# EAGLE design TR_UBL_Splitter_V1p1 (EAGLE 9.6.2)

## Sheet 1 of 2
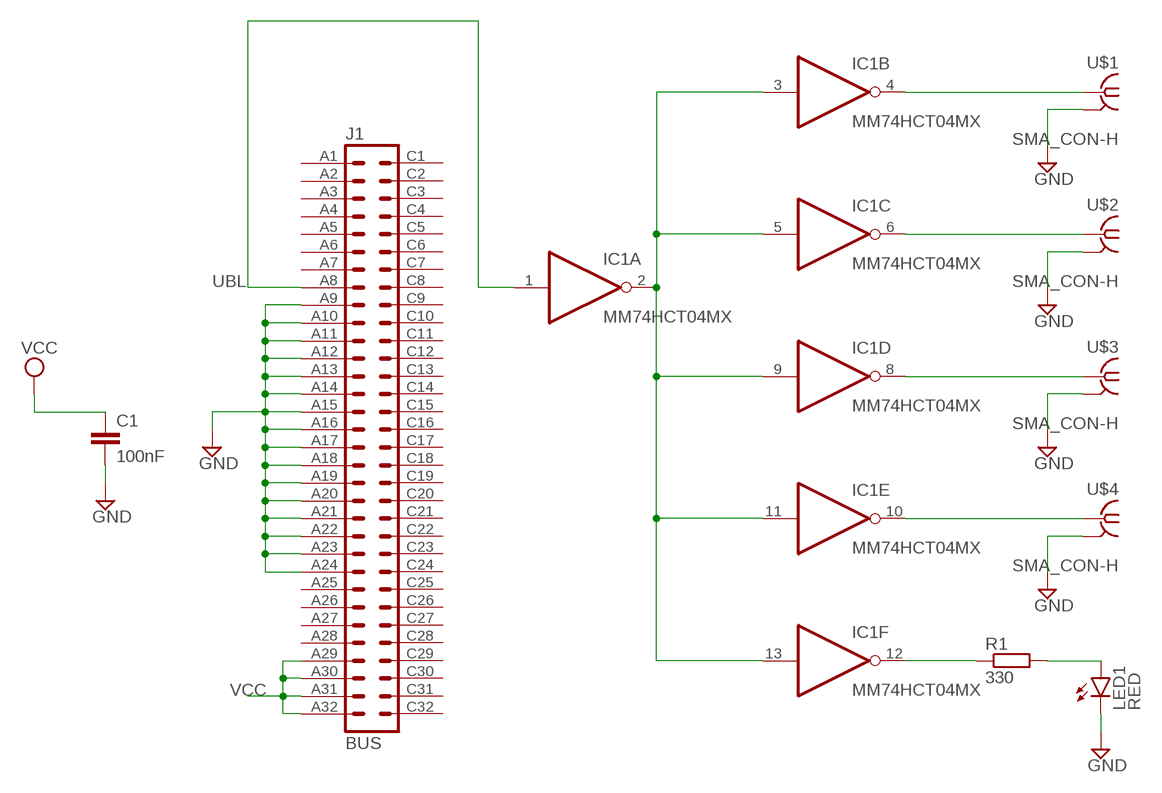
[diagram p0: schematic, sheet 1]

### Parts
C1  100nF  C-EUC0603  [C0603]
IC1  MM74HCT04MX  7404D  [SO14]
J1  BUS  VG64P  [VG64P]
LED1  RED  LED3MM  [LED3MM]
R1  330  R-EU_R0603  [R0603]
U$1  SMA_CON-H  [BU-SMA-H]
U$2  SMA_CON-H  [BU-SMA-H]
U$3  SMA_CON-H  [BU-SMA-H]
U$4  SMA_CON-H  [BU-SMA-H]

### Nets
GND: C1.2 J1.A9 J1.A10 J1.A11 J1.A12 J1.A13 J1.A14 J1.A15 J1.A16 J1.A17 J1.A18 J1.A19 J1.A20 J1.A21 J1.A22 J1.A23 J1.A24 LED1.K(C) U$1.2(GND) U$1.3(GND) U$1.4(GND) U$1.5(GND) U$2.2(GND) U$2.3(GND) U$2.4(GND) U$2.5(GND) U$3.2(GND) U$3.3(GND) U$3.4(GND) U$3.5(GND) U$4.2(GND) U$4.3(GND) U$4.4(GND) U$4.5(GND)
N$1: IC1.2(A:O) IC1.3(B:I) IC1.5(C:I) IC1.9(D:I) IC1.11(E:I) IC1.13(F:I)
N$2: IC1.4(B:O) U$1.1
N$3: LED1.A R1.2
N$4: IC1.6(C:O) U$2.1
N$5: IC1.12(F:O) R1.1
N$6: IC1.8(D:O) U$3.1
N$7: IC1.10(E:O) U$4.1
UBL: IC1.1(A:I) J1.A8
VCC: C1.1 J1.A29 J1.A30 J1.A31 J1.A32
Unconnected: J1.A1 J1.A2 J1.A3 J1.A4 J1.A5 J1.A6 J1.A7 J1.A25 J1.A26 J1.A27 J1.A28 J1.C1 J1.C2 J1.C3 J1.C4 J1.C5 J1.C6 J1.C7 J1.C8 J1.C9 J1.C10 J1.C11 J1.C12 J1.C13 J1.C14 J1.C15 J1.C16 J1.C17 J1.C18 J1.C19 J1.C20 J1.C21 J1.C22 J1.C23 J1.C24 J1.C25 J1.C26 J1.C27 J1.C28 J1.C29 J1.C30 J1.C31 J1.C32

## Sheet 2 of 2

## Power pins joined to a net without a drawn wire
GND: IC1.7(P:GND)
VCC: IC1.14(P:VCC)

## Library data of the parts
C1 = rcl:C-EU: CAPACITOR, European symbol; SPICEPREFIX: C
IC1 = 74xx-us:74*04: Hex INVERTER
J1 = 19inch:VG64: PCB EUROCARD, 64-pin type C/AC, 2.54 mm
LED1 = led:LED: LED OSRAM: - CHIPLED LG R971, LG N971, LY N971, LG Q971, LY Q971, LO R971, LY R971 LH N974, LH R974 LS Q976, LO Q976, LY Q976 LO Q996 - Hyper CHIPLED LW Q18S LB Q993, LB Q99A, LB R99A - SideLED LS A670, LO A670, LY A670, LG A670, LP A670 LB A673, LV A673, LT A673, LW A673 LH A674 LY A675 LS A676, LA A676, LO A676, LY A676, LW A676 LS A679, LY A679, LG A679 - Hyper Micro SIDELED® LS Y876, LA Y876, LO Y876, LY Y876 LT Y87S - SmartLED LW L88C, LW L88S LB L89C, LB L89S, LG L890 LS L89K, LO L89K, LY L89K LS L896, LA L896, LO L896, LY L896 - TOPLED LS T670, LO T670, LY T670, LG T670, LP T670 LSG T670, LSP T670, LSY T670, LOP T670, LYG T670 LG T671, LOG T671, LSG T671 LB T673, LV T673, LT T673, LW T673 LH T674 LS T676, LA T676, LO T676, LY T676, LB T676, LH T676, LSB T676, LW T676 LB T67C, LV T67C, LT T67C, LS T67K, LO T67K, LY T67K, LW E67C LS E67B, LA E67B, LO E67B, LY E67B, LB E67C, LV E67C, LT E67C LW T67C LS T679, LY T679, LG T679 LS T770, LO T770, LY T770, LG T770, LP T770 LB T773, LV T773, LT T773, LW T773 LH T774 LS E675, LA E675, LY E675, LS T675 LS T776, LA T776, LO T776, LY T776, LB T776 LHGB T686 LT T68C, LB T68C - Hyper Mini TOPLED® LB M676 - Mini TOPLED Santana® LG M470 LS M47K, LO M47K, LY M47K Source: http://www.osram.convergy.de LUXEON: - LUMILED® LXK2-PW12-R00, LXK2-PW12-S00, LXK2-PW14-U00, LXK2-PW14-V00 LXK2-PM12-R00, LXK2-PM12-S00, LXK2-PM14-U00 LXK2-PE12-Q00, LXK2-PE12-R00, LXK2-PE12-S00, LXK2-PE14-T00, LXK2-PE14-U00 LXK2-PB12-K00, LXK2-PB12-L00, LXK2-PB12-M00, LXK2-PB14-N00, LXK2-PB14-P00, LXK2-PB14-Q00 LXK2-PR12-L00, LXK2-PR12-M00, LXK2-PR14-Q00, LXK2-PR14-R00 LXK2-PD12-Q00, LXK2-PD12-R00, LXK2-PD12-S00 LXK2-PH12-R00, LXK2-PH12-S00 LXK2-PL12-P00, LXK2-PL12-Q00, LXK2-PL12-R00 Source: www.luxeon.com KINGBRIGHT: KA-3528ASYC Source: www.kingbright.com
R1 = rcl:R-EU_: RESISTOR, European symbol; SPICEPREFIX: R
U$1-U$4 = Orzada:SMA_CON

## Board
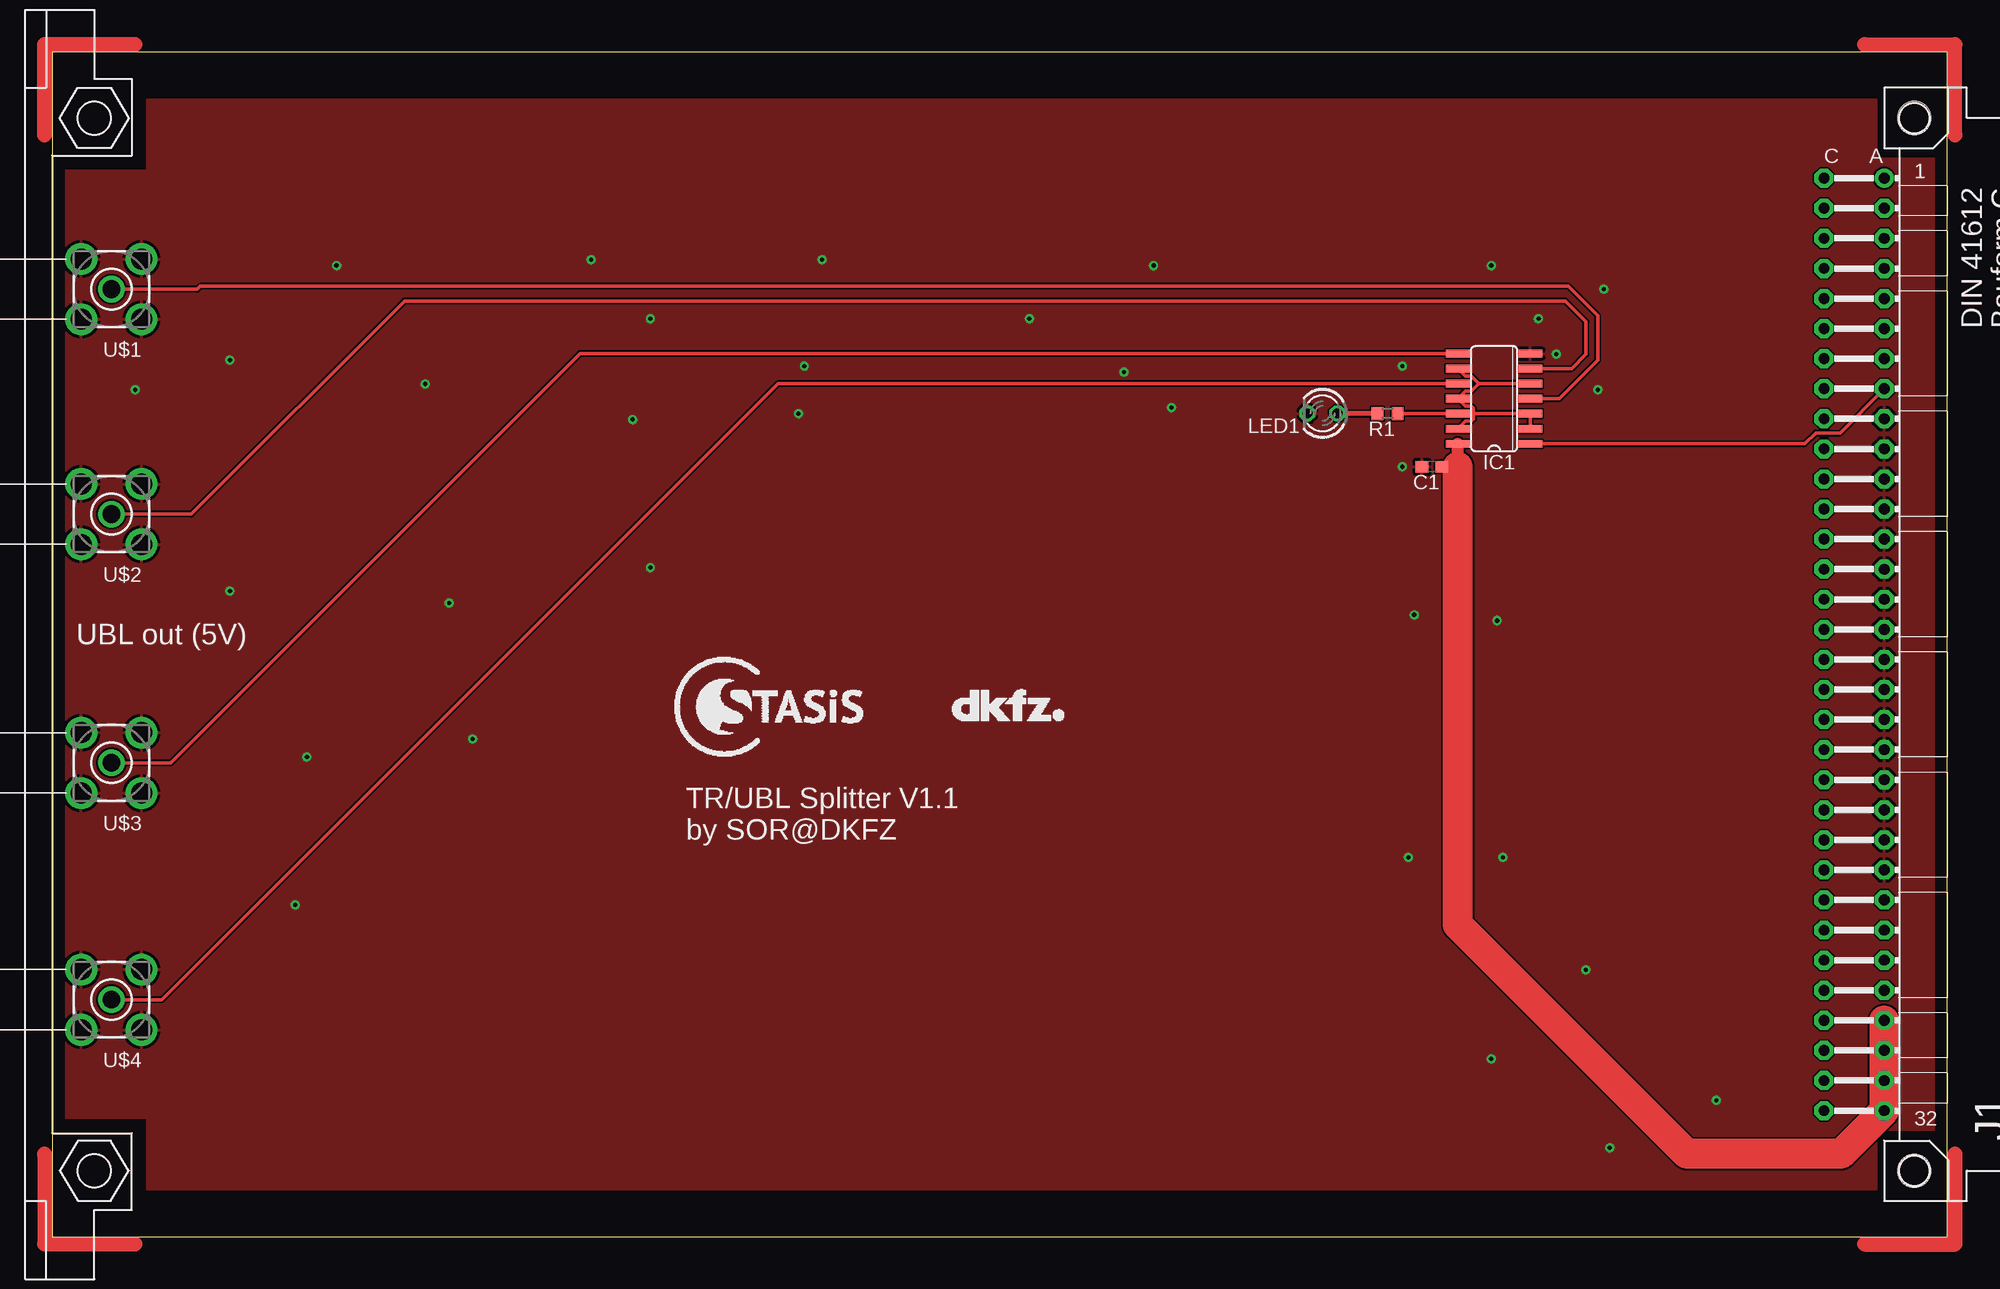
[diagram p1: board, top side]
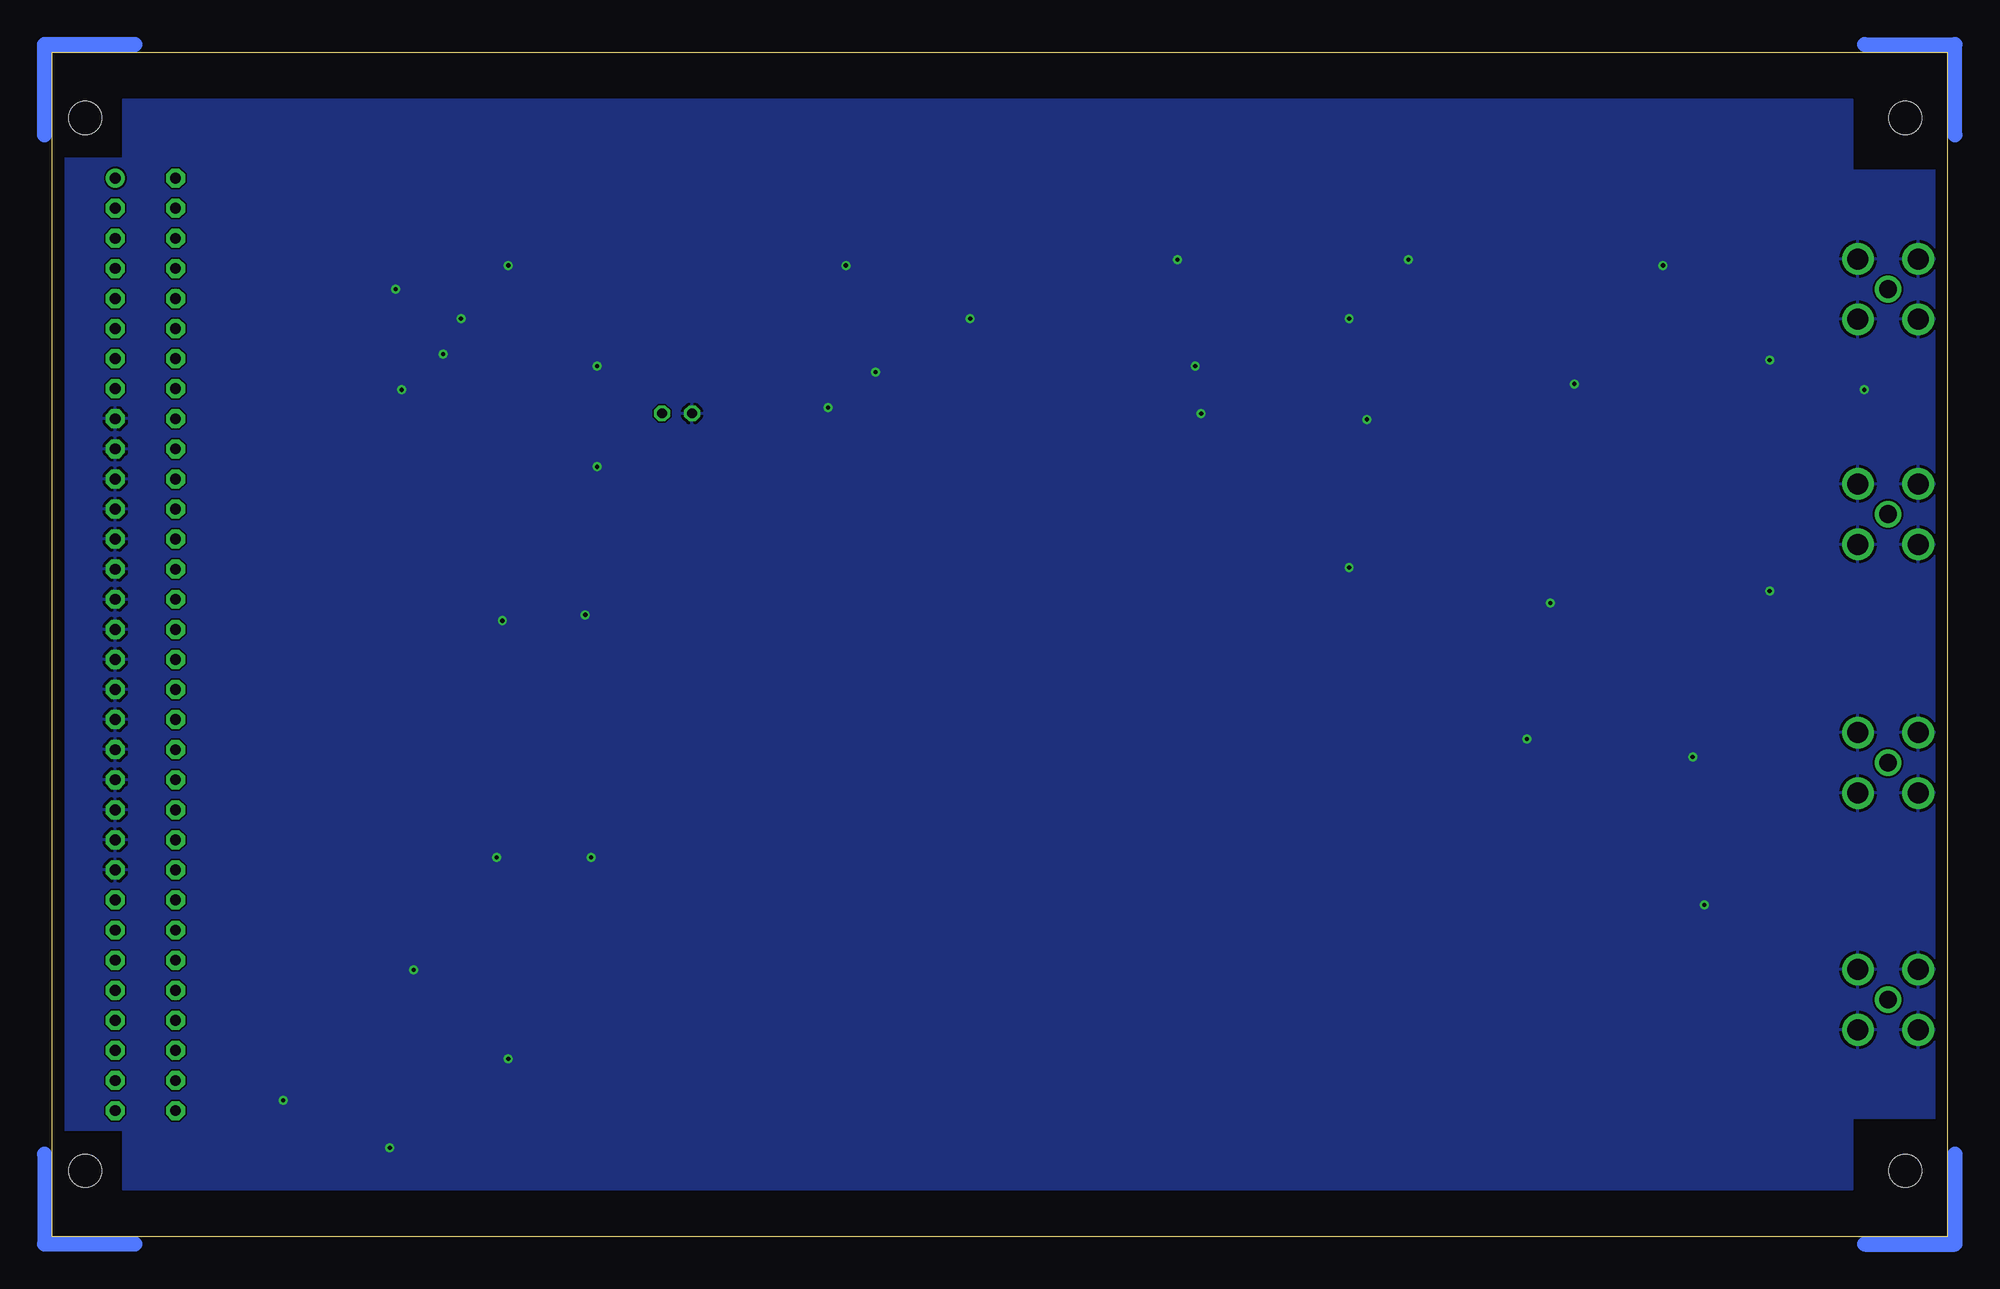
[diagram p2: board, bottom side, seen from below]

Size 160.02 x 100.03 mm. Coordinates in mm from the lower left corner, seen from the top.
Copper layers (1*16): Top 0.035mm / dielectric 1.5mm / Bottom 0.035mm
Design rules "default": minimum track width 6mil, minimum drill 0.35mm, track to track 6mil, track to pad 6mil, pad to pad 6mil, via to via 6mil, smd to smd 6mil, copper to edge 40mil, drill to drill 6mil, minimum pad ring 10mil, minimum via ring 8mil, stop-mask expansion 4mil, vias tented up to drill 0mil, thermal gap 10mil

### Footprints (pad centres in the part's own frame; a part is rotated, then mirrored left to right if it is on the bottom)
C0603 = smd 1.1 x 1: 1 -0.85,0; 2 0.85,0
SO14 = smd 0.66 x 2.032: 1 -3.81,-3.073; 2 -2.54,-3.073; 3 -1.27,-3.073; 4 0,-3.073; 5 1.27,-3.073; 6 2.54,-3.073; 7 3.81,-3.073; 8 3.81,3.073; 9 2.54,3.073; 10 1.27,3.073; 11 0,3.073; 12 -1.27,3.073; 13 -2.54,3.073; 14 -3.81,3.073
VG64P = drill 0.914 pad 1.6: A1 154.94,39.37 | drill 0.914 pad 1.6 octagon: A2 154.94,36.83; A3 154.94,34.29; A4 154.94,31.75; A5 154.94,29.21; A6 154.94,26.67; A7 154.94,24.13; A8 154.94,21.59; A9 154.94,19.05; A10 154.94,16.51; A11 154.94,13.97; A12 154.94,11.43; A13 154.94,8.89; A14 154.94,6.35; A15 154.94,3.81; A16 154.94,1.27; A17 154.94,-1.27; A18 154.94,-3.81; A19 154.94,-6.35; A20 154.94,-8.89; A21 154.94,-11.43; A22 154.94,-13.97; A23 154.94,-16.51; A24 154.94,-19.05; A25 154.94,-21.59; A26 154.94,-24.13; A27 154.94,-26.67; A28 154.94,-29.21; A29 154.94,-31.75; A30 154.94,-34.29; A31 154.94,-36.83; A32 154.94,-39.37; C1 149.86,39.37; C2 149.86,36.83; C3 149.86,34.29; C4 149.86,31.75; C5 149.86,29.21; C6 149.86,26.67; C7 149.86,24.13; C8 149.86,21.59; C9 149.86,19.05; C10 149.86,16.51; C11 149.86,13.97; C12 149.86,11.43; C13 149.86,8.89; C14 149.86,6.35; C15 149.86,3.81; C16 149.86,1.27; C17 149.86,-1.27; C18 149.86,-3.81; C19 149.86,-6.35; C20 149.86,-8.89; C21 149.86,-11.43; C22 149.86,-13.97; C23 149.86,-16.51; C24 149.86,-19.05; C25 149.86,-21.59; C26 149.86,-24.13; C27 149.86,-26.67; C28 149.86,-29.21; C29 149.86,-31.75; C30 149.86,-34.29; C31 149.86,-36.83; C32 149.86,-39.37 | hole 2.794: 3.81,44.45; 3.81,-44.45; 157.48,44.45; 157.48,-44.45
LED3MM = drill 0.813 octagon: A -1.27,0; K 1.27,0
R0603 = smd 1 x 1.1: 1 -0.85,0; 2 0.85,0
BU-SMA-H = drill 1.5: 1 0,0 | drill 1.778: 2 -2.55,2.55; 3 2.55,2.55; 4 2.55,-2.55; 5 -2.55,-2.55

### Placement (x,y rotation side)
C1  116.51,65.01 180 top
IC1  121.76,70.76 90 top
J1  -0.25,50.01 0 top
LED1  107.26,69.51 180 top
R1  112.76,69.51 180 top
U$1  5.01,80.01 180 top
U$2  5.01,61.01 180 top
U$3  5.01,40.01 180 top
U$4  5.01,20.01 180 top
U$5  [LOGO_STASIS]  61.51,44.51 0 top
U$6  [LOGO_DKFZ]  76.01,43.51 0 top

### Tracks (layer width: path | path; a pad name or v marks a point on that pad's centre or on a via)
GND  (via drill 0.35)
  other vias: 114.01,65.01 127.01,74.51 114.01,73.51 90.51,73.01 63.51,73.51 49.01,69.01 33.51,53.51 21.51,40.51 15.01,54.51 31.51,72.01 50.51,77.51 82.51,77.51 94.51,70.01 125.51,77.51 130.51,71.51 131.01,80.01 121.51,82.01 93.01,82.01 65.01,82.51 45.51,82.51 24.01,82.01 15.01,74.01 7.01,71.51 63.01,69.51 50.51,56.51 35.51,42.01 20.51,28.01 122.01,52.01 115.01,52.51 114.51,32.01 122.51,32.01 121.51,15.01 129.51,22.51 140.51,11.51 131.51,7.51
  pour Bottom: 8.01,96.01 8.01,90.01 1.01,90.01 1.01,10.01 8.01,10.01 8.01,4.01 154.01,4.01 154.01,9.01 159.01,9.01 159.01,91.01 154.01,91.01 154.01,96.01
  pour Top: 8.01,96.01 8.01,90.01 1.01,90.01 1.01,10.01 8.01,10.01 8.01,4.01 154.01,4.01 154.01,9.01 159.01,9.01 159.01,91.01 154.01,91.01 154.01,96.01
N$1
  Top 0.305: IC1.9 119.32,72.67 119.83,72.67 120.46,72.03 | IC1.5 120.46,72.03 | 120.46,72.03 119.83,71.4 119.32,71.4 IC1.11 119.32,70.13 119.83,70.13 120,69.95 120,69.51 | 120,69.51 120,69.04 119.83,68.86 119.32,68.86 IC1.13 | 120,69.51 120.02,69.49 IC1.3 IC1.2
N$2
  Top 0.305: IC1.4 127.26,70.76 130.51,74.01 130.51,77.76 128.01,80.26 12.51,80.26 12.26,80.01 U$1.1
N$3
  Top 0.406: R1.2 LED1.A
N$4
  Top 0.305: IC1.6 128.3,73.3 129.51,74.51 129.51,77.26 127.76,79.01 29.76,79.01 11.76,61.01 U$2.1
N$5
  Top 0.305: IC1.12 113.63,69.49 R1.1
N$6
  Top 0.305: IC1.8 44.57,74.57 10.01,40.01 U$3.1
N$7
  Top 0.305: IC1.10 61.28,72.03 9.26,20.01 U$4.1
UBL
  Top 0.305: IC1.1 147.97,66.95 148.9,67.88 150.96,67.88 J1.A8
VCC
  Top 1.016: IC1.14 118.68,65.59 118.76,65.51 118.68,65.01 C1.1
  Top 2.54: J1.A29 J1.A30 J1.A31 J1.A32 151.06,7.01 138.01,7.01 118.68,26.34 118.68,65.01

### Text on the board
tPlace: UBL out (5V) | TR/UBL Splitter V1.1 / by SOR@DKFZ
Document: SMA-Con, 6.6mm height (board to center)